# EAGLE design usbprog_v3_1 (EAGLE 4.16)
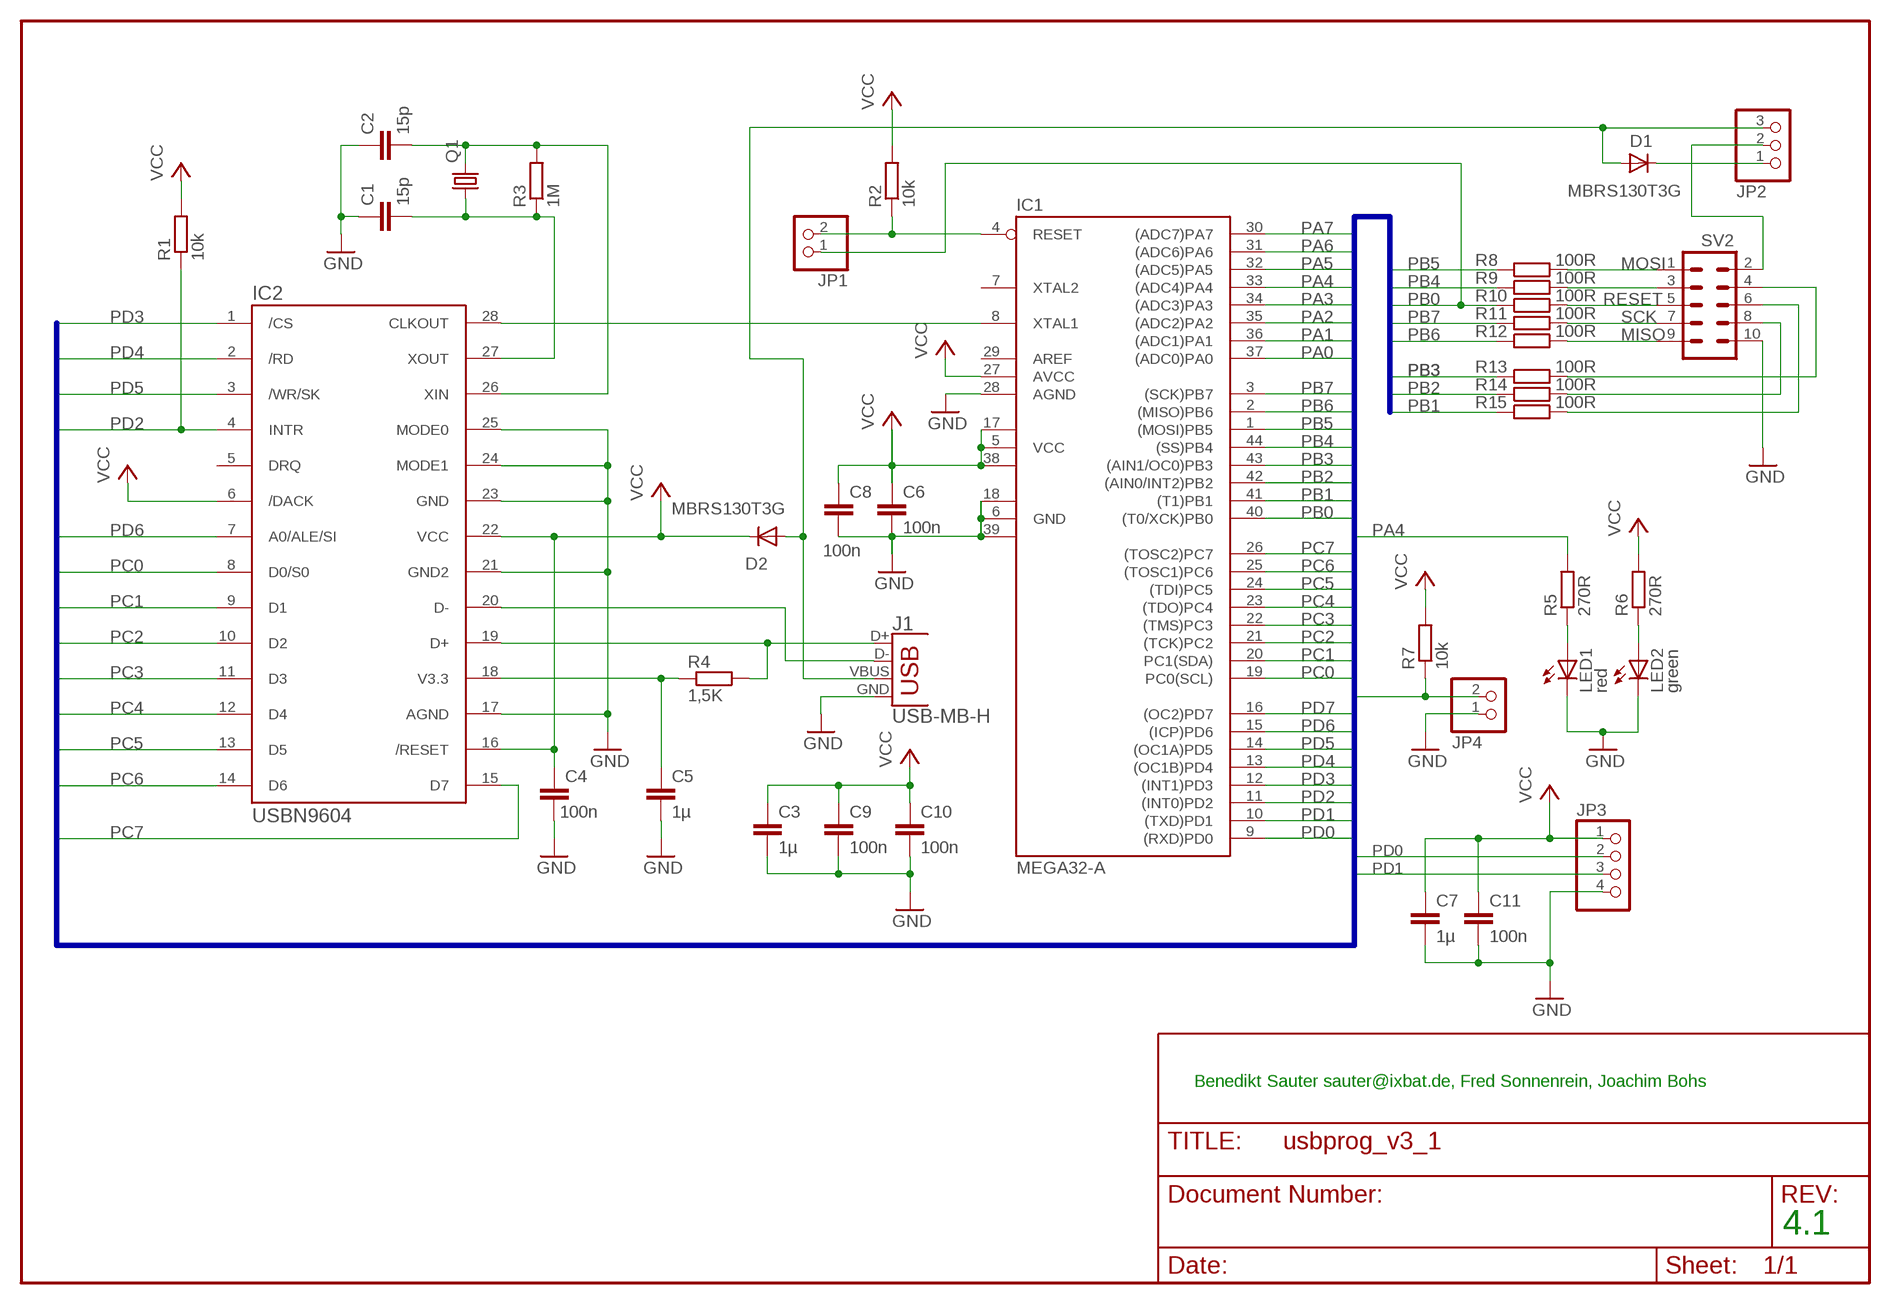
[diagram p0: schematic, sheet 1]

## Parts
C1  15p  C-EUC0603  [C0603]
C2  15p  C-EUC0603  [C0603]
C3  1µ  C-EUC0603  [C0603]
C4  100n  C-EUC0603  [C0603]
C5  1µ  C-EUC0603  [C0603]
C6  100n  C-EUC0603  [C0603]
C7  1µ  C-EUC0603  [C0603]
C8  100n  C-EUC0603  [C0603]
C9  100n  C-EUC0603  [C0603]
C10  100n  C-EUC0603  [C0603]
C11  100n  C-EUC0603  [C0603]
D1  MBRS130T3G  DIODE-MELF-MLL41  [MELF-MLL41]
D2  MBRS130T3G  DIODE-MELF-MLL41  [MELF-MLL41]
IC1  MEGA32-A  [TQFP44]
IC2  USBN9604  [SO28-3]
J1  USB-MB-H  [USB-MB-H]
JP1  PINHD-1X2  [1X02]
JP2  PINHD-1X3  [1X03]
JP3  PINHD-1X4  [1X04]
JP4  PINHD-1X2  [1X02]
LED1  red  LED3MM  [LED3MM]
LED2  green  LED3MM  [LED3MM]
Q1  CRYSTALHC49U-V  [HC49U-V]
R1  10k  R-EU_R0603  [R0603]
R2  10k  R-EU_R0603  [R0603]
R3  1M  R-EU_R0603  [R0603]
R4  1,5K  R-EU_R0603  [R0603]
R5  270R  R-EU_R0603  [R0603]
R6  270R  R-EU_R0603  [R0603]
R7  10k  R-EU_R1206  [R1206]
R8  100R  R-EU_R1206  [R1206]
R9  100R  R-EU_R1206  [R1206]
R10  100R  R-EU_R1206  [R1206]
R11  100R  R-EU_R1206  [R1206]
R12  100R  R-EU_R1206  [R1206]
R13  100R  R-EU_R1206  [R1206]
R14  100R  R-EU_R1206  [R1206]
R15  100R  R-EU_R1206  [R1206]
SV2  ML10L  [ML10L]

## Nets
GND: C1.1 C2.1 C3.2 C4.2 C5.2 C6.2 C7.2 C8.2 C9.2 C10.2 C11.2 IC1.6(GND) IC1.18(GND1) IC1.28(AGND) IC1.39(GND2) IC2.17(AGND) IC2.21(GND2) IC2.23(GND) IC2.24(MODE1) IC2.25(MODE0) J1.GND JP3.4 JP4.1 LED1.K(C) LED2.K(C) SV2.10
N$1: D1.A D2.A J1.VBUS JP2.3
N$3: D1.C JP2.1
N$4: IC1.8(XTAL1) IC2.28(CLKOUT)
N$5: R14.2 SV2.8
N$6: JP2.2 SV2.2
N$7: C5.1 IC2.18(V3.3) R4.1
N$8: C2.2 IC2.26(XIN) Q1.2 R3.2
N$9: LED1.A R5.1
N$10: LED2.A R6.1
N$11: C1.2 IC2.27(XOUT) Q1.1 R3.1
N$12: IC2.19(D+) J1.D+ R4.2
N$13: R15.2 SV2.6
N$14: R13.2 SV2.4
N$15: IC2.20(D-) J1.D-
N$16: R12.2 SV2.9
N$17: R11.2 SV2.7
N$18: R10.2 SV2.5
N$19: R9.2 SV2.3
N$20: R8.2 SV2.1
PA0: IC1.37((ADC0)PA0)
PA1: IC1.36((ADC1)PA1)
PA2: IC1.35((ADC2)PA2)
PA3: IC1.34((ADC3)PA3)
PA4: IC1.33((ADC4)PA4) R5.2
PA5: IC1.32((ADC5)PA5)
PA6: IC1.31((ADC6)PA6)
PA7: IC1.30((ADC7)PA7) JP4.2 R7.1
PB0: IC1.40((T0/XCK)PB0) JP1.1 R10.1
PB1: IC1.41((T1)PB1) R15.1
PB2: IC1.42((AIN0/INT2)PB2) R14.1
PB3: IC1.43((AIN1/OC0)PB3) R13.1
PB4: IC1.44((SS)PB4) R9.1
PB5: IC1.1((MOSI)PB5) R8.1
PB6: IC1.2((MISO)PB6) R12.1
PB7: IC1.3((SCK)PB7) R11.1
PC0: IC1.19(PC0(SCL)) IC2.8(D0/S0)
PC1: IC1.20(PC1(SDA)) IC2.9(D1)
PC2: IC1.21((TCK)PC2) IC2.10(D2)
PC3: IC1.22((TMS)PC3) IC2.11(D3)
PC4: IC1.23((TDO)PC4) IC2.12(D4)
PC5: IC1.24((TDI)PC5) IC2.13(D5)
PC6: IC1.25((TOSC1)PC6) IC2.14(D6)
PC7: IC1.26((TOSC2)PC7) IC2.15(D7)
PD0: IC1.9((RXD)PD0) JP3.2
PD1: IC1.10((TXD)PD1) JP3.3
PD2: IC1.11((INT0)PD2) IC2.4(INTR) R1.1
PD3: IC1.12((INT1)PD3) IC2.1(/CS)
PD4: IC1.13((OC1B)PD4) IC2.2(/RD)
PD5: IC1.14((OC1A)PD5) IC2.3(/WR/SK)
PD6: IC1.15((ICP)PD6) IC2.7(A0/ALE/SI)
PD7: IC1.16((OC2)PD7)
RESET: IC1.4(RESET) JP1.2 R2.1
VCC: C3.1 C4.1 C6.1 C7.1 C8.1 C9.1 C10.1 C11.1 D2.C IC1.5(VCC) IC1.17(VCC1) IC1.27(AVCC) IC1.38(VCC2) IC2.6(/DACK) IC2.16(/RESET) IC2.22(VCC) JP3.1 R1.2 R2.2 R6.2 R7.2
Unconnected: IC1.7(XTAL2) IC2.5(DRQ)

## Buses
PD0,PD1,PD2,PD3,PD4,PD5,PD6,PD7,PC0,PC1,PC2,PC3,PC4,PC5,PC6,PC7,PB0,PB1,PB2,PB3,PB4,PB5,PB6,PB7,PA0,PA1,PA2,PA3,PA4,PA5,PA6,PA7

## Notes on the sheet
- MOSI
- PB4
- RESET
- SCK
- MISO
- PB3 | PB3
- PB2
- PB1
- Benedikt Sauter sauter@ixbat.de, Fred Sonnenrein, Joachim Bohs
- 4.1

## Power pins joined to a net without a drawn wire
AREF: IC1.29(AREF)

## Library data of the parts
C1-C11 = rcl:C-EU: CAPACITOR, European symbol
D1 D2 = diode:DIODE-: DIODE
IC1 = avr:MEGA32: MICROCONTROLLER 32 Kbytes FLASH 2 Kbytes SRAM 1 Kbytes EEPROM USART 8-channel 10 bit ADC
IC2 = bene:USBN9604
J1 = con-usb:USB: USB Connectors
JP1 JP4 = pinhead:PINHD-1X2: PIN HEADER
JP2 = pinhead:PINHD-1X3: PIN HEADER
JP3 = pinhead:PINHD-1X4: PIN HEADER
LED1 LED2 = led:LED: LED OSRAM: - CHIPLED LG R971, LG N971, LY N971, LG Q971, LY Q971, LO R971, LY R971 LH N974, LH R974 LS Q976, LO Q976, LY Q976 LO Q996 - Hyper CHIPLED LW Q18S LB Q993, LB Q99A, LB R99A - SideLED LS A670, LO A670, LY A670, LG A670, LP A670 LB A673, LV A673, LT A673, LW A673 LH A674 LY A675 LS A676, LA A676, LO A676, LY A676, LW A676 LS A679, LY A679, LG A679 - Hyper Micro SIDELED® LS Y876, LA Y876, LO Y876, LY Y876 LT Y87S - SmartLED LW L88C, LW L88S LB L89C, LB L89S, LG L890 LS L89K, LO L89K, LY L89K LS L896, LA L896, LO L896, LY L896 - TOPLED LS T670, LO T670, LY T670, LG T670, LP T670 LSG T670, LSP T670, LSY T670, LOP T670, LYG T670 LG T671, LOG T671, LSG T671 LB T673, LV T673, LT T673, LW T673 LH T674 LS T676, LA T676, LO T676, LY T676, LB T676, LH T676, LSB T676, LW T676 LB T67C, LV T67C, LT T67C, LS T67K, LO T67K, LY T67K, LW E67C LS E67B, LA E67B, LO E67B, LY E67B, LB E67C, LV E67C, LT E67C LW T67C LS T679, LY T679, LG T679 LS T770, LO T770, LY T770, LG T770, LP T770 LB T773, LV T773, LT T773, LW T773 LH T774 LS E675, LA E675, LY E675, LS T675 LS T776, LA T776, LO T776, LY T776, LB T776 LHGB T686 LT T68C, LB T68C - Hyper Mini TOPLED® LB M676 - Mini TOPLED Santana® LG M470 LS M47K, LO M47K, LY M47K Source: http://www.osram.convergy.de/
Q1 = crystal:CRYSTAL: CRYSTAL
R1-R15 = rcl:R-EU_: RESISTOR, European symbol
SV2 = con-harting-ml:ML10: HARTING

## Board
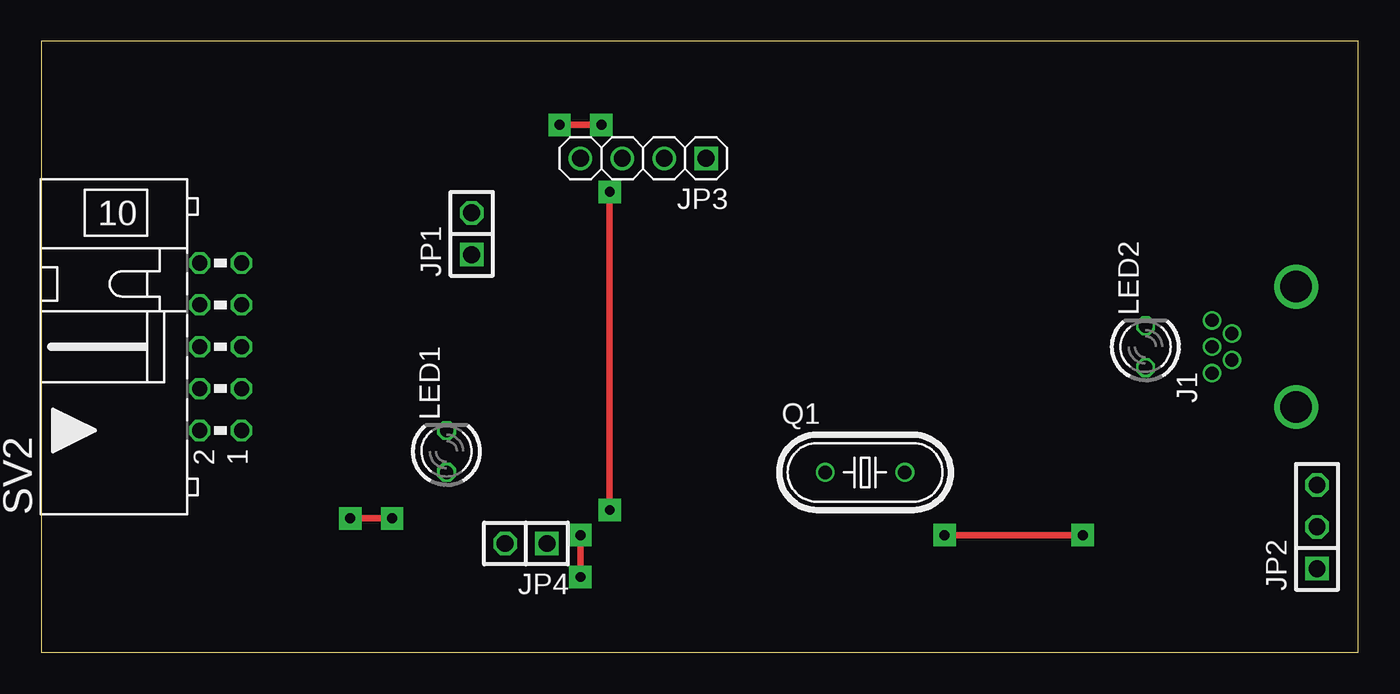
[diagram p1: board, top side]
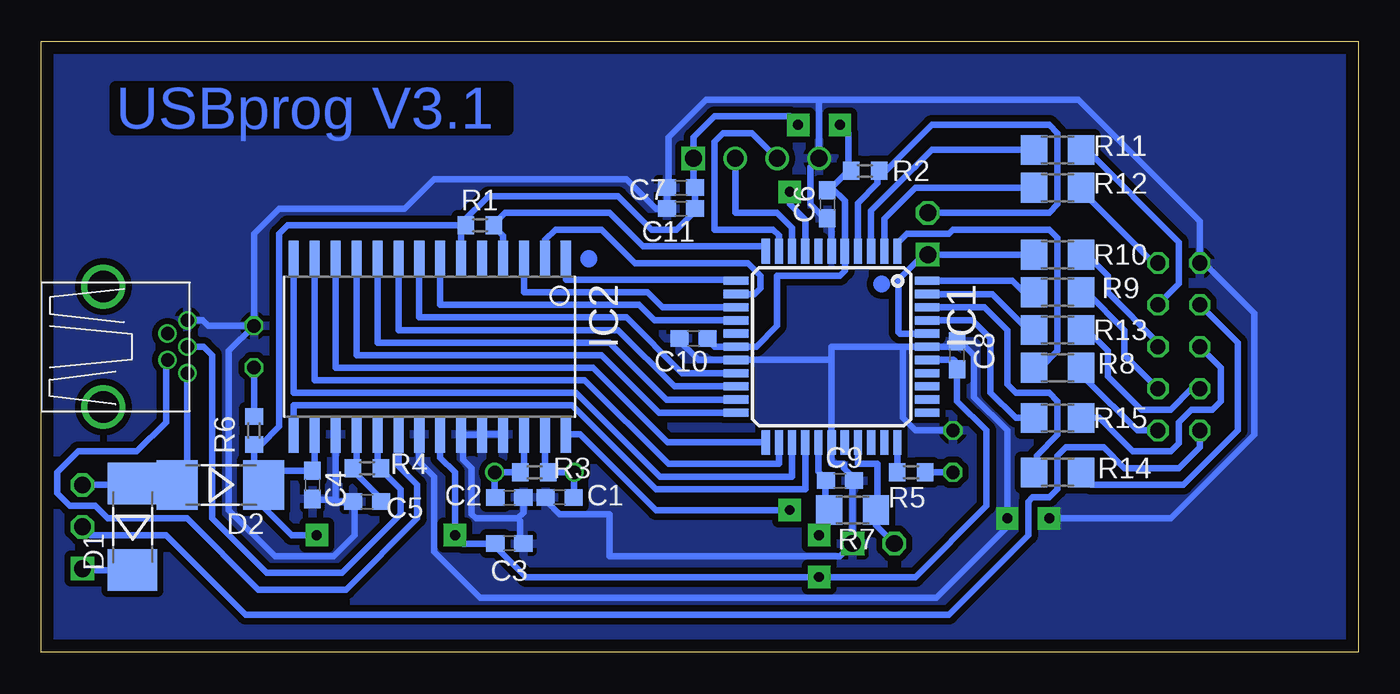
[diagram p2: board, bottom side, seen from below]

Size 79.93 x 37.07 mm. Coordinates in mm from the lower left corner, seen from the top.
Outline: 0,0 79.93,0 79.93,37.07 0,37.07 0,0
Copper layers (1*16): Top 0.035mm / dielectric 1.5mm / Bottom 0.035mm
Design rules "homemade": minimum track width 15mil, minimum drill 20mil, track to track 15mil, track to pad 15mil, pad to pad 15mil, via to via 15mil, smd to smd 8mil, copper to edge 30mil, drill to drill 20mil, minimum pad ring 5mil, minimum via ring 15mil, stop-mask expansion 4mil, vias tented up to drill 0mil, thermal gap 10mil

### Footprints (pad centres in the part's own frame; a part is rotated, then mirrored left to right if it is on the bottom)
C0603 = smd 1.1 x 1: 1 -0.85,0; 2 0.85,0
MELF-MLL41 = smd 2.5 x 3: A 2.625,0; C -2.625,0
TQFP44 = smd 1.5 x 0.5: 1 -5.8,4; 2 -5.8,3.2; 3 -5.8,2.4; 4 -5.8,1.6; 5 -5.8,0.8; 6 -5.8,0; 7 -5.8,-0.8; 8 -5.8,-1.6; 9 -5.8,-2.4; 10 -5.8,-3.2; 11 -5.8,-4; 23 5.8,-4; 24 5.8,-3.2; 25 5.8,-2.4; 26 5.8,-1.6; 27 5.8,-0.8; 28 5.8,0; 29 5.8,0.8; 30 5.8,1.6; 31 5.8,2.4; 32 5.8,3.2; 33 5.8,4 | smd 0.5 x 1.5: 12 -4,-5.8; 13 -3.2,-5.8; 14 -2.4,-5.8; 15 -1.6,-5.8; 16 -0.8,-5.8; 17 0,-5.8; 18 0.8,-5.8; 19 1.6,-5.8; 20 2.4,-5.8; 21 3.2,-5.8; 22 4,-5.8; 34 4,5.8; 35 3.2,5.8; 36 2.4,5.8; 37 1.6,5.8; 38 0.8,5.8; 39 0,5.8; 40 -0.8,5.8; 41 -1.6,5.8; 42 -2.4,5.8; 43 -3.2,5.8; 44 -4,5.8
SO28-3 = smd 0.61 x 2.21: 1 -8.255,-5.315; 2 -6.985,-5.315; 3 -5.715,-5.315; 4 -4.445,-5.315; 5 -3.175,-5.315; 6 -1.905,-5.315; 7 -0.635,-5.315; 8 0.635,-5.315; 9 1.905,-5.315; 10 3.175,-5.315; 11 4.445,-5.315; 12 5.715,-5.315; 13 6.985,-5.315; 14 8.255,-5.315; 15 8.255,5.315; 16 6.985,5.315; 17 5.715,5.315; 18 4.445,5.315; 19 3.175,5.315; 20 1.905,5.315; 21 0.635,5.315; 22 -0.635,5.315; 23 -1.905,5.315; 24 -3.175,5.315; 25 -4.445,5.315; 26 -5.715,5.315; 27 -6.985,5.315; 28 -8.255,5.315
USB-MB-H = drill 0.8 round: D+ 5.1,0; D- 3.9,0.8; GND 5.1,-1.6; ID 3.9,-0.8; VBUS 5.1,1.6 | drill 1.9 round: P$6 0,-3.65; P$7 0,3.65
1X02 = drill 1.016 square: 1 -1.27,0 | drill 1.016 octagon: 2 1.27,0
1X03 = drill 1.016 square: 1 -2.54,0 | drill 1.016 octagon: 2 0,0; 3 2.54,0
1X04 = drill 1.016 square: 1 -3.81,0 | drill 1.016 round: 2 -1.27,0; 3 1.27,0; 4 3.81,0
LED3MM = drill 0.813 octagon: A -1.27,0; K 1.27,0
HC49U-V = drill 0.813 round: 1 -2.413,0; 2 2.413,0
R0603 = smd 1 x 1.1: 1 -0.85,0; 2 0.85,0
R1206 = smd 1.6 x 1.803: 1 -1.422,0; 2 1.422,0
ML10L = drill 0.914 octagon: 1 -5.08,-1.27; 2 -5.08,1.27; 3 -2.54,-1.27; 4 -2.54,1.27; 5 0,-1.27; 6 0,1.27; 7 2.54,-1.27; 8 2.54,1.27; 9 5.08,-1.27; 10 5.08,1.27

### Placement (x,y rotation side)
C1  48.48,9.39 0 bottom
C2  51.52,9.39 180 bottom
C3  51.52,6.6 0 bottom
C4  63.46,10.15 270 bottom
C5  60.16,9.14 180 bottom
C6  32.22,27.17 270 bottom
C7  41.11,28.19 180 bottom
C8  24.35,18.03 90 bottom
C9  31.46,10.41 0 bottom
C10  40.35,19.05 180 bottom
C11  41.11,26.92 180 bottom
D1  74.38,7.62 90 bottom
D2  69.05,10.15 180 bottom
IC1  31.97,18.54 270 bottom
IC2  56.35,18.54 180 bottom
J1  76.16,18.54 180 top
JP1  26.12,25.39 90 top
JP2  77.43,7.62 90 top
JP3  36.54,29.97 180 top
JP4  29.43,6.6 180 top
LED1  24.6,12.19 90 top
LED2  67.02,18.54 90 top
Q1  50,10.92 0 top
R1  53.3,25.9 180 bottom
R2  29.93,29.21 180 bottom
R3  50,10.92 180 bottom
R4  60.16,11.17 0 bottom
R5  27.14,10.92 180 bottom
R6  67.02,13.46 270 bottom
R7  30.7,8.63 180 bottom
R8  18.25,17.27 0 bottom
R9  18.25,21.84 0 bottom
R10  18.25,24.12 0 bottom
R11  18.25,30.48 0 bottom
R12  18.25,28.19 0 bottom
R13  18.25,19.55 0 bottom
R14  18.25,10.92 0 bottom
R15  18.25,14.22 0 bottom
SV2  10.88,18.54 90 top

### Tracks (layer width: path | path; a pad name or v marks a point on that pad's centre or on a via)
GND  (via drill 0.6)
  Top 0.406: v18.76,8.12 v21.3,8.12
  Bottom 0.406: C10.2 41.36,19.05 40.06,17.74 IC1.18 32,17.74 31.97,17.78 | IC2.25 53.03,13.22 53.05,13.2 | C2.1 50.67,8.46 51.02,8.12 | 51.02,8.12 53.56,8.12 53.81,8.38 53.81,11.17 54.32,11.68 54.32,13.2 | IC2.24 53.07,13.22 53.05,13.2 | 54.32,13.2 54.34,13.22 IC2.23 | 54.32,13.2 53.05,13.2 | IC1.6 31.97,25.9 32.22,26.16 C6.2 32.39,26.32 33.24,27.17 33.24,29.46 JP3.4 32.73,33.52 | 62.07,9.27 IC2.17 | 62.07,9.27 61.94,9.14 C5.2 60.92,9.14 60.92,7.11 62.19,5.84 65.75,5.84 68.54,8.63 68.54,18.28 LED2.K | 62.07,9.27 63.34,9.27 63.46,9.14 C4.2 63.46,9.39 | 71.08,20.14 J1.GND 70.14,20.14 69.81,19.81 LED2.K | 27.65,18.54 31.97,18.54 31.97,17.78 | 27.65,18.54 IC1.39 24.6,18.54 24.35,18.79 C8.2 24.18,18.88 23.33,18.03 23.33,15.49 21.3,13.46 v21.3,8.12 21.3,7.62 25.62,3.3 53.3,3.3 56.1,6.09 56.1,10.66 56.99,11.55 IC2.21 | 31.97,17.78 IC1.28 31.97,11.42 31.2,11.42 31.2,11.17 30.7,10.66 30.7,10.41 | 27.65,18.54 27.65,14.22 26.89,13.46 LED1.K | C1.1 49.33,9.23 48.48,8.38 45.43,8.38 45.43,5.84 31.46,5.84 JP4.1 30.7,10.41 | 51.02,8.12 50.89,7.99 50.89,6.72 50.76,6.6 C3.2 | 32.73,33.52 16.98,33.52 9.61,26.16 SV2.10 9.36,23.62 6.31,20.57 6.31,13.2 11.39,8.12 v18.76,8.12 | 32.73,33.52 39.59,33.52 41.87,31.24 41.87,28.19 C7.2 41.96,27.09 42.13,26.92 C11.2 42.63,26.92 44.41,28.7 56.1,28.7 57.87,26.92 65.49,26.92 67.02,25.39 LED2.K | 30.7,10.41 C9.2
  pour Bottom: -0.04,37.08 79.97,37.08 79.97,-0.01 -0.04,-0.01
N$1
  Bottom 0.406: 71.59,10.15 71.51,10.07 | J1.VBUS 71.06,10.68 71.59,10.15 | 71.59,10.15 D2.A 74.38,10.15 | 71.59,10.15 71.67,10.24 | 74.38,10.15 D1.A | 74.38,10.15 JP2.3
N$3
  Bottom 0.406: D1.C 77.35,4.99 JP2.1
N$4  (via drill 0.6)
  Top 0.406: v34.51,8.63 v34.51,27.94
  Bottom 0.406: IC1.8 33.57,26.23 34.51,27.17 v34.51,27.94 | IC2.28 47.23,13.22 42.63,8.63 v34.51,8.63
N$5
  Bottom 0.406: SV2.8 7.33,18.79 7.33,13.46 10.63,10.15 16.22,10.15 16.98,10.92 R14.2
N$6
  Bottom 0.406: SV2.2 9.61,12.44 10.88,11.17 14.19,11.17 15.46,12.44 17.74,12.44 18.25,11.93 18.25,9.9 18.76,9.39 19.77,9.39 20.03,9.14 20.03,7.11 24.85,2.28 67.53,2.28 72.35,7.11 76.92,7.11 JP2.2
N$7
  Bottom 0.406: IC2.18 60.8,11.3 60.92,11.17 R4.1 61.01,11 59.4,9.39 59.4,9.23 C5.1
N$8
  Bottom 0.406: IC2.26 50.64,11.04 50.76,10.92 R3.2 Q1.2 52.41,9.52 52.29,9.39 C2.2
N$9
  Bottom 0.406: LED1.A R5.1
N$10
  Bottom 0.406: 67.02,14.22 R6.1 LED2.A
N$11
  Bottom 0.406: IC2.27 49.37,11.04 49.24,10.92 | 49.24,10.92 R3.1 | 49.24,10.92 Q1.1 47.59,9.52 47.71,9.39 C1.2
N$12
  Bottom 0.406: IC2.19 59.53,11.3 59.4,11.17 | 59.4,11.17 R4.2 | 59.4,11.17 58.13,9.9 58.13,8.38 61.68,4.82 66.26,4.82 69.56,8.12 69.56,18.03 70.07,18.54 J1.D+
N$13
  Bottom 0.406: SV2.6 8.34,17.27 8.34,15.23 8.85,14.73 10.12,14.73 10.88,13.96 10.88,12.69 11.39,12.19 13.68,12.19 15.71,14.22 R15.2
N$14
  Bottom 0.406: SV2.4 10.12,16 11.39,14.73 13.17,14.73 15.2,16.76 15.2,18.28 16.47,19.55 R13.2
N$15
  Bottom 0.406: IC2.20 58.26,11.3 57.11,10.15 57.11,8.12 61.43,3.81 66.76,3.81 71.08,8.12 75.91,8.12 76.67,8.88 78.19,8.88 78.96,9.65 78.96,10.92 77.69,12.19 74.13,12.19 72.35,13.96 72.35,17.52 72.26,17.61 72.26,17.69 72.31,17.74 | 72.31,17.74 72.35,17.78 | 72.31,17.74 J1.D-
N$16
  Bottom 0.406: R12.2 16.98,28.19 12.41,23.62 SV2.9
N$17
  Bottom 0.406: SV2.7 10.88,22.35 10.88,24.89 16.47,30.48 R11.2
N$18
  Bottom 0.406: 16.85,24 16.73,23.87 | 16.85,24 16.98,24.12 | SV2.5 12.15,18.79 15.2,21.84 15.2,22.86 16.47,24.12 16.73,24.12 | 16.73,24.12 16.85,24 | 16.73,24.12 R10.2
N$19
  Bottom 0.406: SV2.3 14.19,18.03 14.19,19.55 16.47,21.84 R9.2
N$20
  Bottom 0.406: SV2.1 13.42,13.46 16.47,16.51 16.47,16.76 16.83,17.12 R8.2
PA4
  Bottom 0.406: R5.2 28.16,10.92 27.97,11.11 IC1.33
PA7
  Bottom 0.406: JP4.2 29.27,7.72 R7.1 29.27,8.99 29.43,9.14 29.17,9.39 29.17,11.42 30.37,11.42 IC1.30
PB0
  Bottom 0.406: IC1.40 27.81,19.34 27.9,19.43 27.9,22.6 26.38,24.12 JP1.1 R10.1
PB1
  Bottom 0.406: IC1.41 23.41,20.14 22.31,19.05 22.31,15.74 20.79,14.22 R15.1
PB2
  Bottom 0.406: IC1.42 22.68,20.94 21.3,19.55 21.3,16.25 20.79,15.74 18.76,15.74 18.25,15.23 18.25,13.2 19.52,11.93 19.52,10.92 R14.1 19.67,11.02 19.52,11.17
PB3
  Bottom 0.406: IC1.43 22.21,21.74 20.03,19.55 R13.1
PB4
  Bottom 0.406: IC1.44 20.98,22.54 20.28,21.84 R9.1
PB5
  Bottom 0.406: IC1.1 27.97,24.82 27.39,25.39 24.85,25.39 24.6,25.65 18.76,25.65 18.25,25.14 18.25,18.28 19.27,17.27 R8.1
PB6
  Bottom 0.406: IC1.2 28.77,26.31 27.01,28.06 26.89,28.19 R12.1
PB7
  Bottom 0.406: IC1.3 29.57,26.78 27.14,29.21 | 27.14,29.21 26.89,29.46 | 27.14,29.21 25.87,30.48 R11.1
PC0
  Bottom 0.406: IC2.8 56.99,20.32 44.41,20.32 41.03,16.94 IC1.19
PC1
  Bottom 0.406: IC2.9 58.26,19.55 44.92,19.55 41.5,16.14 IC1.20
PC2
  Bottom 0.406: IC2.10 59.53,18.79 45.43,18.79 41.97,15.34 IC1.21
PC3
  Bottom 0.406: IC2.11 60.8,18.03 45.94,18.03 42.44,14.54 IC1.22
PC4
  Bottom 0.406: IC2.12 62.07,17.27 46.44,17.27 41.91,12.74 IC1.23
PC5
  Bottom 0.406: IC2.13 63.34,16.51 46.95,16.51 41.87,11.42 35.17,11.42 IC1.24
PC6
  Bottom 0.406: IC2.14 64.61,15.74 47.46,15.74 42.38,10.66 34.37,10.66 IC1.25
PC7
  Bottom 0.406: 64.61,13.2 IC2.15 64.61,14.98 47.71,14.98 42.63,9.9 33.57,9.9 IC1.26
PD0
  Bottom 0.406: IC1.9 34.37,25.76 35.27,26.67 37.81,26.67 JP3.2
PD1
  Bottom 0.406: JP3.3 36.79,31.49 38.57,31.49 39.08,30.98 39.08,25.65 35.52,25.65 35.17,25.29 IC1.10
PD2
  Bottom 0.406: IC2.4 51.91,25.27 52.54,25.9 | IC1.11 35.97,24.63 43.4,24.63 45.43,26.67 51.78,26.67 52.54,25.9 | 52.54,25.9 R1.1
PD3
  Bottom 0.406: IC1.12 37.83,22.6 48.1,22.6 IC2.1 48.1,23.87
PD4
  Bottom 0.406: IC1.13 36.64,21.74 36.28,22.09 36.28,22.86 37.05,23.62 43.9,23.62 45.94,25.65 48.73,25.65 49.37,25.01 IC2.2
PD5
  Bottom 0.406: 42.38,21.08 42.25,20.95 | 42.38,21.08 43.14,21.84 50.64,21.84 IC2.3 | IC1.14 42.24,20.94 42.38,21.08
PD6
  Bottom 0.406: IC2.7 55.72,21.08 43.65,21.08 42.71,20.14 IC1.15
RESET
  Bottom 0.406: IC1.4 30.37,27.25 29.17,28.44 | R2.1 29.17,29.21 29.17,28.44 | 29.17,28.44 29.17,28.7 25.87,32 18.76,32 18.25,31.49 18.25,27.17 18.76,26.67 JP1.2
VCC  (via drill 0.6)
  Top 0.406: v32.73,4.57 v32.73,7.11 | v34,32 v31.46,32 | v54.83,7.11 v63.21,7.11
  Bottom 0.406: C10.1 39.59,19.05 39.08,18.54 IC1.17 36.54,18.54 35.27,19.81 35.27,22.86 31.46,22.86 31.17,23.15 IC1.5 31.17,27.39 31.97,28.19 32.13,28.02 C6.1 32.22,27.94 31.2,28.95 30.95,28.95 30.95,29.21 | 30.95,29.21 R2.2 | 63.63,11 63.72,10.92 | 63.63,11 C4.1 65.66,11 66.42,10.24 D2.C | IC2.16 63.34,11.3 63.63,11 | IC2.22 55.72,11.81 54.83,10.92 v54.83,7.11 54.32,6.6 52.54,6.6 | IC1.38 24.56,17.74 24.35,17.52 C8.1 24.35,15.23 22.57,13.46 22.57,8.88 26.89,4.57 v32.73,4.57 50.51,4.57 52.54,6.6 | 40.26,26.75 40.35,26.67 | 40.26,26.75 C11.1 C7.1 40.35,28.19 JP3.1 40.35,31.24 39.08,32.51 34.51,32.51 v34,32 | 40.26,26.75 41.36,25.65 42.89,25.65 44.92,27.68 52.79,27.68 54.32,26.16 54.15,25.99 R1.2 54.32,25.9 | v31.46,32 30.95,31.49 30.95,29.21 | D2.C 66.51,10.15 67.02,10.66 R6.2 66.6,12.61 65.49,13.71 65.49,25.39 64.99,25.9 54.32,25.9 | IC2.6 54.45,25.78 54.32,25.9 | 52.54,6.6 C3.1 | 66.42,8.88 D2.C | 66.42,8.88 66.42,8.8 | 66.42,8.88 66.51,8.88 64.73,7.11 v63.21,7.11 | IC1.27 32.77,10.96 32.22,10.41 | 32.22,10.41 C9.1 | 32.22,10.41 32.35,10.28 32.35,8.63 R7.2 | R7.2 31.97,8.63 | v32.73,7.11 32.73,8.63 R7.2
(copper drawn outside any net)
  shapes: Bottom circle x2

### Text on the board
Bottom: USBprog V3.1